# EAGLE design MS5611 (EAGLE 7.1.0)
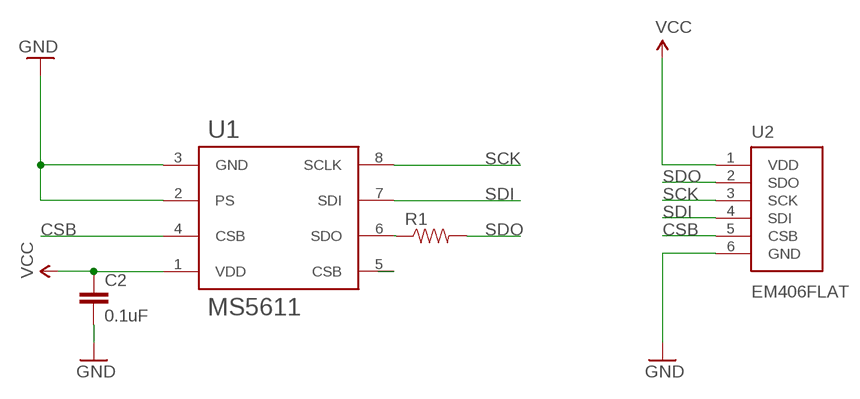
[diagram p0: schematic, sheet 1]

## Parts
C2  0.1uF  CAP0603-CAP  [0603-CAP]
R1  RESISTOR0603-RES  [0603-RES]
U1  MS5611  [QFN-8]
U2  EM406FLAT  [EM406-FLAT]

## Nets
CSB: U1.4(CSB) U2.5(CSB)
GND: C2.2 U1.2(PS) U1.3(GND) U2.6(GND)
N$2: R1.1 U1.6(SDO)
N$3: U1.5(CSB)
SCK: U1.8(SCLK) U2.3(SCK)
SDI: U1.7(SDI) U2.4(SDI)
SDO: R1.2 U2.2(SDO)
VCC: C2.1 U1.1(VDD) U2.1(VDD)

## Library data of the parts
C2 = SparkFun-Capacitors:CAP: Capacitor Standard 0603 ceramic capacitor, and 0.1" leaded capacitor.
R1 = SparkFun-Passives:RESISTOR: Resistor Basic schematic elements and footprints for 0603, 1206, and PTH resistors.
U1 = icarus_sensors:MS5611: MS5611 pressure sensor in QFN-8 package
U2 = icarus_sensors:EM406: EM406 GPS Connector Proven layout and schematic for EM406 connector. Spark Fun Electronics SKU : GPS-00579

## Board
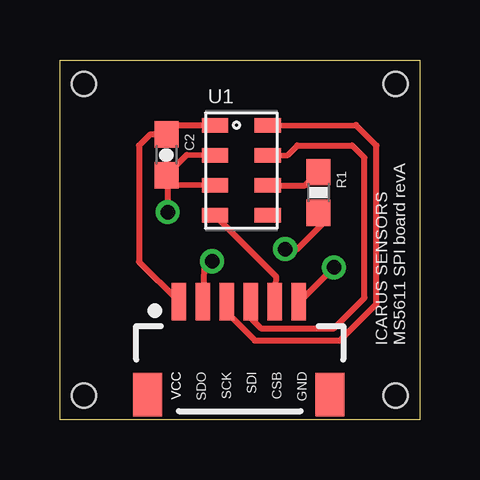
[diagram p1: board, top side]
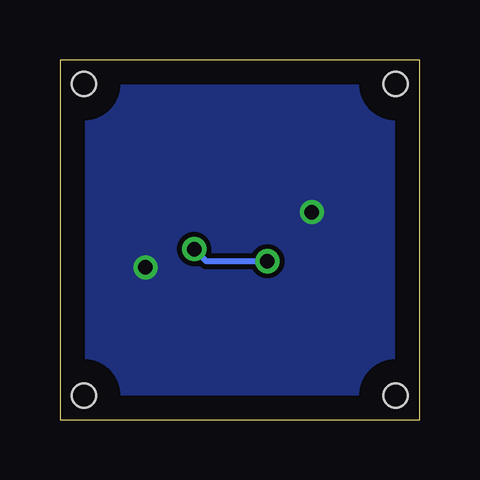
[diagram p2: board, bottom side, seen from below]

Size 15 x 15 mm. Coordinates in mm from the lower left corner, seen from the top.
Outline: 0,0 0,15 15,15 15,0 0,0
Copper layers (1*16): Top 0.035mm / dielectric 1.5mm / Bottom 0.035mm
Design rules "default": minimum track width 10mil, minimum drill 24mil, track to track 8mil, track to pad 8mil, pad to pad 8mil, via to via 8mil, smd to smd 8mil, copper to edge 40mil, drill to drill 8mil, minimum pad ring 10mil, minimum via ring 8mil, stop-mask expansion 4mil, vias tented up to drill 0mil, thermal gap 10mil
Holes 1 mm at 1,14 14,14 14,1 1,1

### Footprints (pad centres in the part's own frame; a part is rotated, then mirrored left to right if it is on the bottom)
0603-CAP = smd 1.1 x 1: 1 -0.85,0; 2 0.85,0
0603-RES = smd 1.1 x 1: 1 -0.85,0; 2 0.85,0
QFN-8 = smd 1.1 x 0.6: 1 -1.1,1.875; 2 -1.1,0.625; 3 -1.1,-0.625; 4 -1.1,-1.875; 5 1.1,-1.875; 6 1.1,-0.625; 7 1.1,0.625; 8 1.1,1.875
EM406-FLAT = smd 0.6 x 1.55: 1 -2.54,2.92; 2 -1.54,2.92; 3 -0.54,2.92; 4 0.46,2.92; 5 1.46,2.92; 6 2.46,2.92 | smd 1.2 x 1.8: P$1 -3.84,-0.955; P$2 3.76,-0.955

### Placement (x,y rotation side)
C2  4.44,11.04 270 top
R1  10.78,9.47 270 top
U1  7.57,10.39 0 top
U2  7.5,2 0 top

### Tracks (layer width: path | path; a pad name or v marks a point on that pad's centre or on a via)
CSB
  Top 0.254: 9.14,4.57 9.03,4.69 U2.5 9.03,5.95 U1.4
GND  (via drill 0.6)
  Top 0.254: C2.2 4.49,10.19 v4.49,8.65 | U1.2 5.29,11.04 C2.2 | U1.3 4.84,9.79 C2.2 | U2.6 10.19,5.11 v11.43,6.35
  pour Bottom: 0.7,14.3 14.4,14.3 14.3,0.7 0.7,0.7
N$2
  Top 0.254: U1.6 10.22,9.76 R1.1
SCK
  Top 0.254: U2.3 7.03,4.4 8.13,3.3 11.68,3.3 13.21,4.83 13.21,11.43 12.35,12.29 U1.8
SDI
  Top 0.254: U2.4 8.03,4.16 8.38,3.81 11.43,3.81 12.7,5.08 12.7,10.92 12.19,11.43 9.91,11.43 9.52,11.04 U1.7
SDO  (via drill 0.6)
  Top 0.254: U2.2 6.03,6.28 v6.35,6.6 | v9.4,7.11 9.91,7.11 10.92,8.13 10.92,8.48 R1.2
  Bottom 0.254: v6.35,6.6 8.89,6.6 v9.4,7.11
VCC
  Top 0.254: U1.1 4.44,12.26 C2.1 3.76,11.89 3.3,11.43 3.3,6.58 U2.1

### Text on the board
tNames: ICARUS SENSORS / MS5611 SPI board revA